# Altium schematic sheet FOC.SchDoc
size A3; SheetNumber: 1; SheetTotal: 6
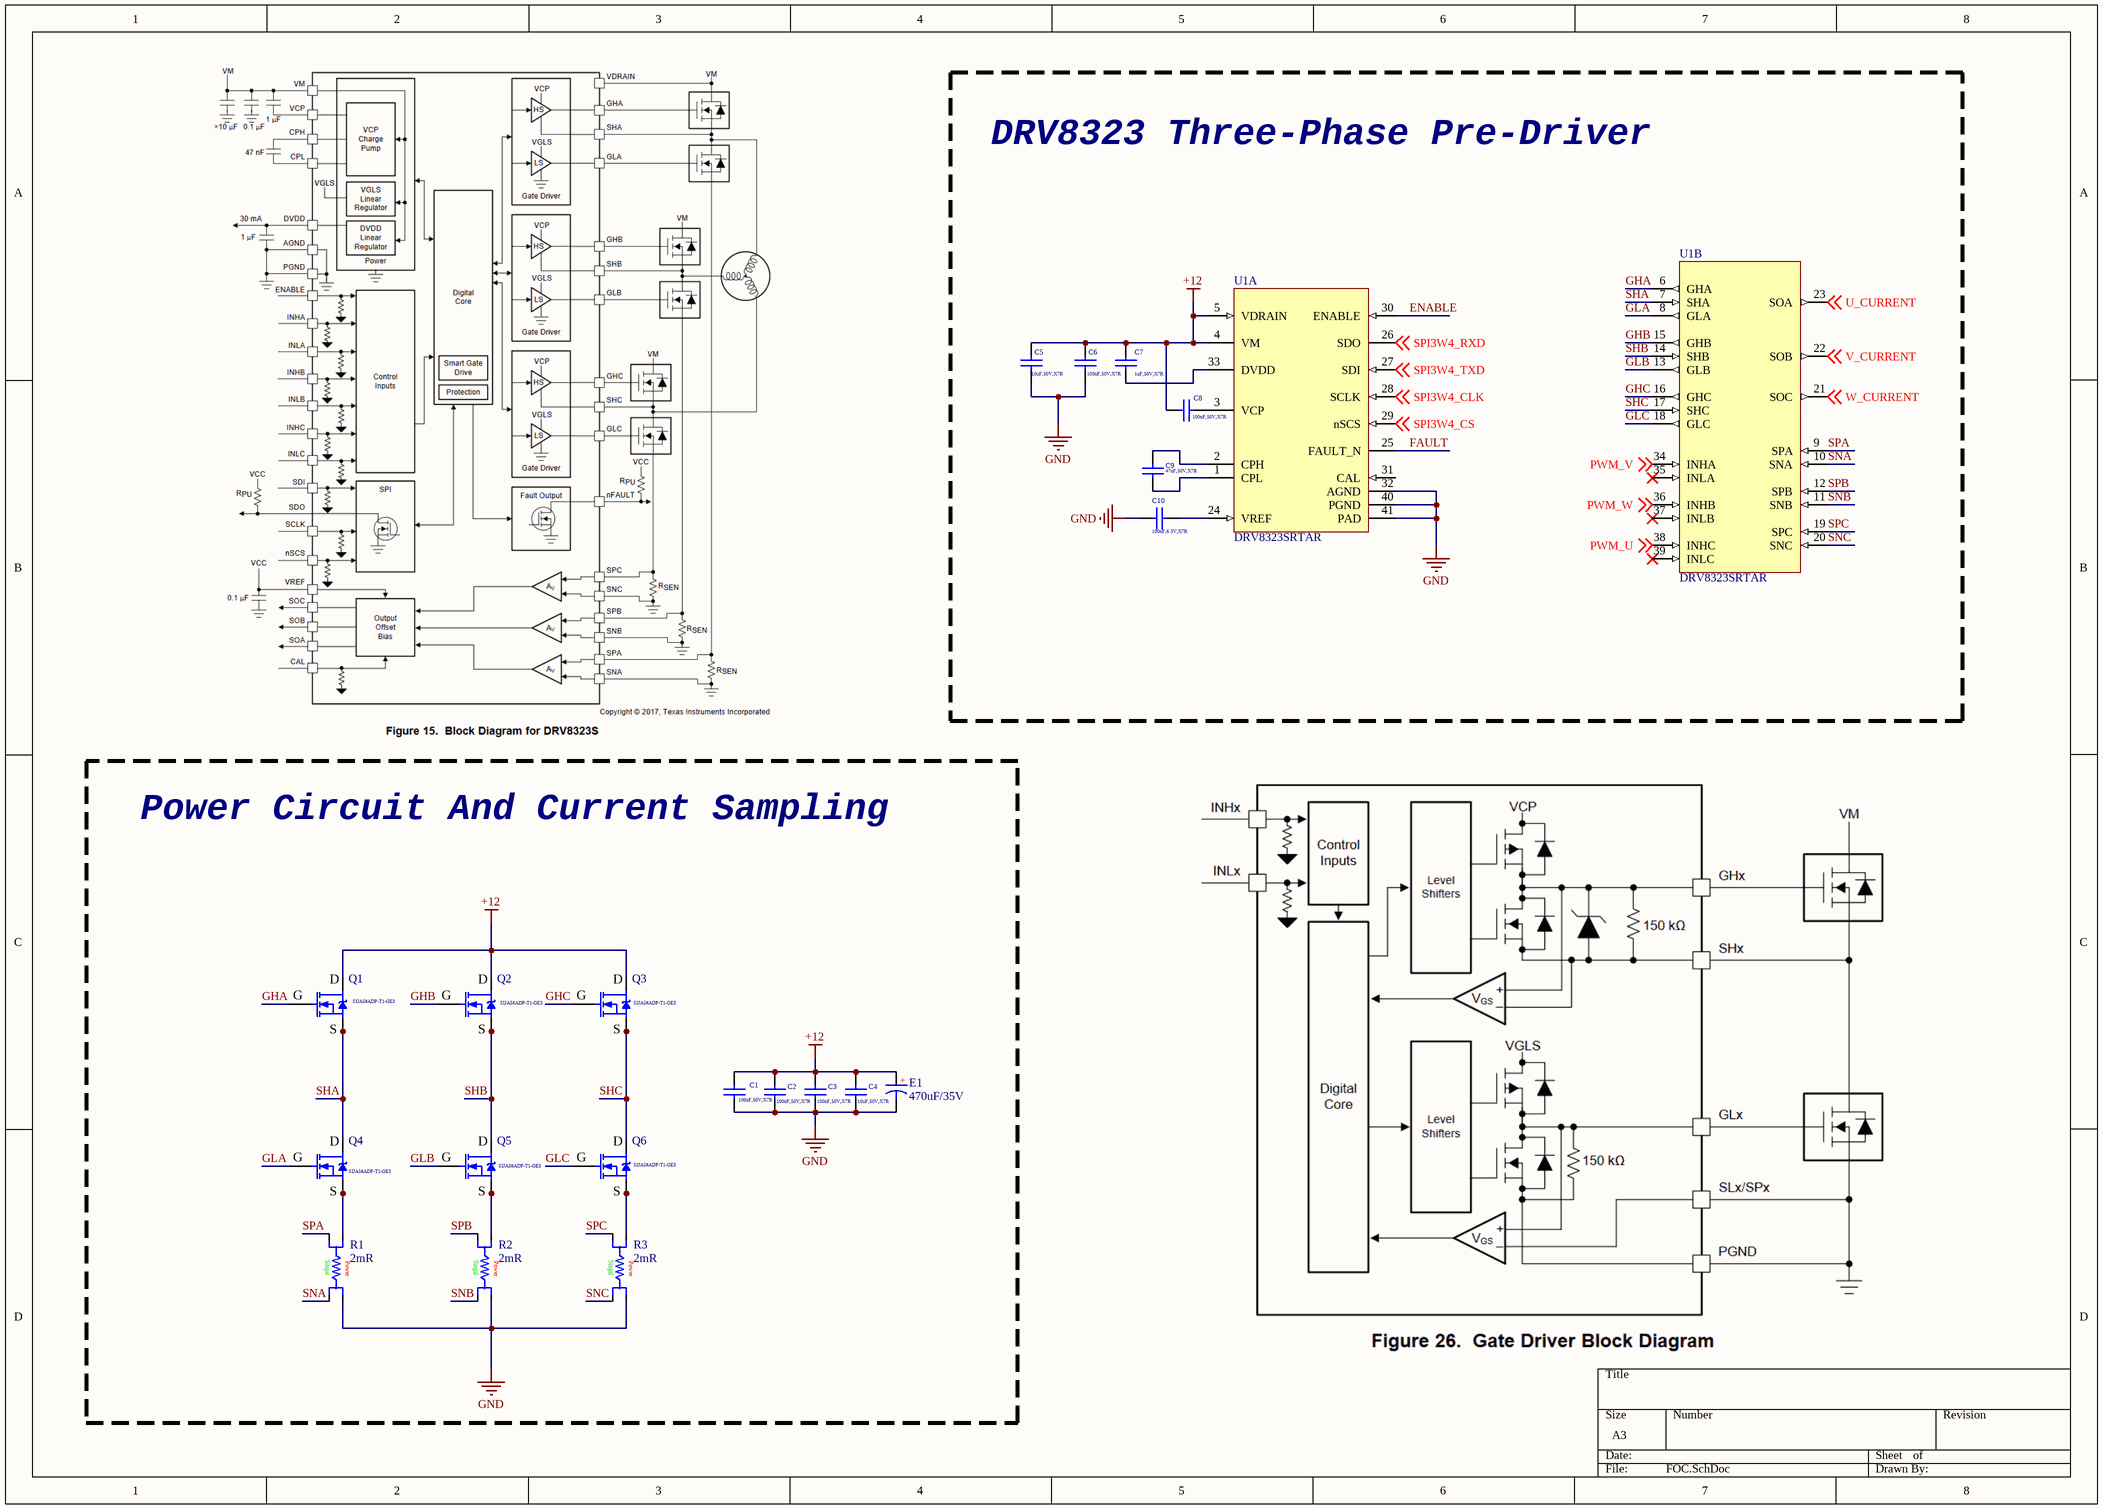
[diagram p0: FOC.SchDoc]

## Parts
C1  100nF,50V,X7R  [C0603_L]
C2  100nF,50V,X7R  [C0603_L]
C3  100nF,50V,X7R  [C0603_L]
C4  10uF,50V,X7R  [C0603_L]
C5  10uF,50V,X7R  [C0402_L]
C6  100nF,50V,X7R  [C0402_L]
C7  1uF,50V,X7R  [C0402_L]
C8  100nF,50V,X7R  [C0402_L]
C9  47nF,50V,X7R  [C0402_L]
C10  100nF,6.3V,X7R  [C0402_L]
E1  470uF/35V  [CE E(8*6.2)]
Q1  SIJA58ADP-T1-GE3  [POWERPAK SO-8L_VIS]
Q2  SIJA58ADP-T1-GE3  [POWERPAK SO-8L_VIS]
Q3  SIJA58ADP-T1-GE3  [POWERPAK SO-8L_VIS]
Q4  SIJA58ADP-T1-GE3  [POWERPAK SO-8L_VIS]
Q5  SIJA58ADP-T1-GE3  [POWERPAK SO-8L_VIS]
Q6  SIJA58ADP-T1-GE3  [POWERPAK SO-8L_VIS]
R1  2mR  [WSKW0612_VIS]
R2  2mR  [WSKW0612_VIS]
R3  2mR  [WSKW0612_VIS]
U1  DRV8323SRTAR  [DRV8323SRTAR-Footprint-1]  (parts A,B of 2)

## Blocks framed on the sheet
DRV8323 Three-Phase Pre-Driver: C5-C10 U1
Power Circuit And Current Sampling: C1-C4 E1 Q1-Q6 R1-R3

## Nets
+12: C1.1 C2.1 C3.1 C4.1 C5.2 C6.2 C7.1 C8.1 E1.1 Q1.5(D) Q2.5(D) Q3.5(D) U1.4(VM) U1.5(VDRAIN)
GND: C1.2 C2.2 C3.2 C4.2 C5.1 C6.1 C10.1 E1.2 R1.4 R2.4 R3.4 U1.32(AGND) U1.40(PGND) U1.41(PAD)
ENABLE: U1.30(ENABLE)
FAULT: U1.25(FAULT_N)
GHA: Q1.4(G) U1.6(GHA)
GHB: Q2.4(G) U1.15(GHB)
GHC: Q3.4(G) U1.16(GHC)
GLA: Q4.4(G) U1.8(GLA)
GLB: Q5.4(G) U1.13(GLB)
GLC: Q6.4(G) U1.18(GLC)
PWM_U: U1.38(INHC) ; off-sheet PWM_U
PWM_V: U1.34(INHA) ; off-sheet PWM_V
PWM_W: U1.36(INHB) ; off-sheet PWM_W
SHA: Q1.1(S) Q1.2(S) Q1.3(S) Q4.5(D) U1.7(SHA)
SHB: Q2.1(S) Q2.2(S) Q2.3(S) Q5.5(D) U1.14(SHB)
SHC: Q3.1(S) Q3.2(S) Q3.3(S) Q6.5(D) U1.17(SHC)
SNA: R1.3 U1.10(SNA)
SNB: R2.3 U1.11(SNB)
SNC: R3.3 U1.20(SNC)
SPA: R1.2 U1.9(SPA)
SPB: R2.2 U1.12(SPB)
SPC: R3.2 U1.19(SPC)
SPI3W4_CLK: U1.28(SCLK) ; off-sheet SPI3W4_CLK
SPI3W4_CS: U1.29(nSCS) ; off-sheet SPI3W4_CS
SPI3W4_RXD: U1.26(SDO) ; off-sheet SPI3W4_RXD
SPI3W4_TXD: U1.27(SDI) ; off-sheet SPI3W4_TXD
U_CURRENT: U1.23(SOA) ; off-sheet U_CURRENT
V_CURRENT: U1.22(SOB) ; off-sheet V_CURRENT
W_CURRENT: U1.21(SOC) ; off-sheet W_CURRENT
NetC7_2: C7.2 U1.33(DVDD)
NetC8_2: C8.2 U1.3(VCP)
NetC9_1: C9.1 U1.2(CPH)
NetC9_2: C9.2 U1.1(CPL)
NetC10_2: C10.2 U1.24(VREF)
NetQ4_1: Q4.1(S) Q4.2(S) Q4.3(S) R1.1
NetQ5_1: Q5.1(S) Q5.2(S) Q5.3(S) R2.1
NetQ6_1: Q6.1(S) Q6.2(S) Q6.3(S) R3.1

Not connected (* = marked no-connect by the designer): U1 31(CAL) 35(INLA)* 37(INLB)* 39(INLC)*

## Notes on the sheet
- (in symbol CE_SMD) +
- (in symbol CMP-00060-2) Singal; Power

## Library data of the parts
C1-C10 = C: 贴片电容/MLCC电容; BOM名称: 无极性贴片电容; 当前库版本V2023.5.31 @淘宝卖家:黄晶宝石: 最新版本发布https://item.taobao.com/item.htm?id=566775463719
E1 = CE_SMD: 贴片电解电容; 当前库版本V2023.5.31 @淘宝卖家:黄晶宝石: 最新版本发布https://item.taobao.com/item.htm?id=566775463719; BOM名称: 贴片电解电容
Q1-Q6 = CMP-00055-2: Power Field-Effect Transistor
R1-R3 = CMP-00060-2: SMD Chip Resistor, 2 MOhm, ± 1%, 1 W, 0612 [1632 Metric], Metal Strip, High Power
U1 = CMP-00062-1: 65-V max 3-phase smart gate driver with current shunt amplifiers 40-WQFN -40 to 125